# EAGLE schematic Schematico (EAGLE 9.6.2)
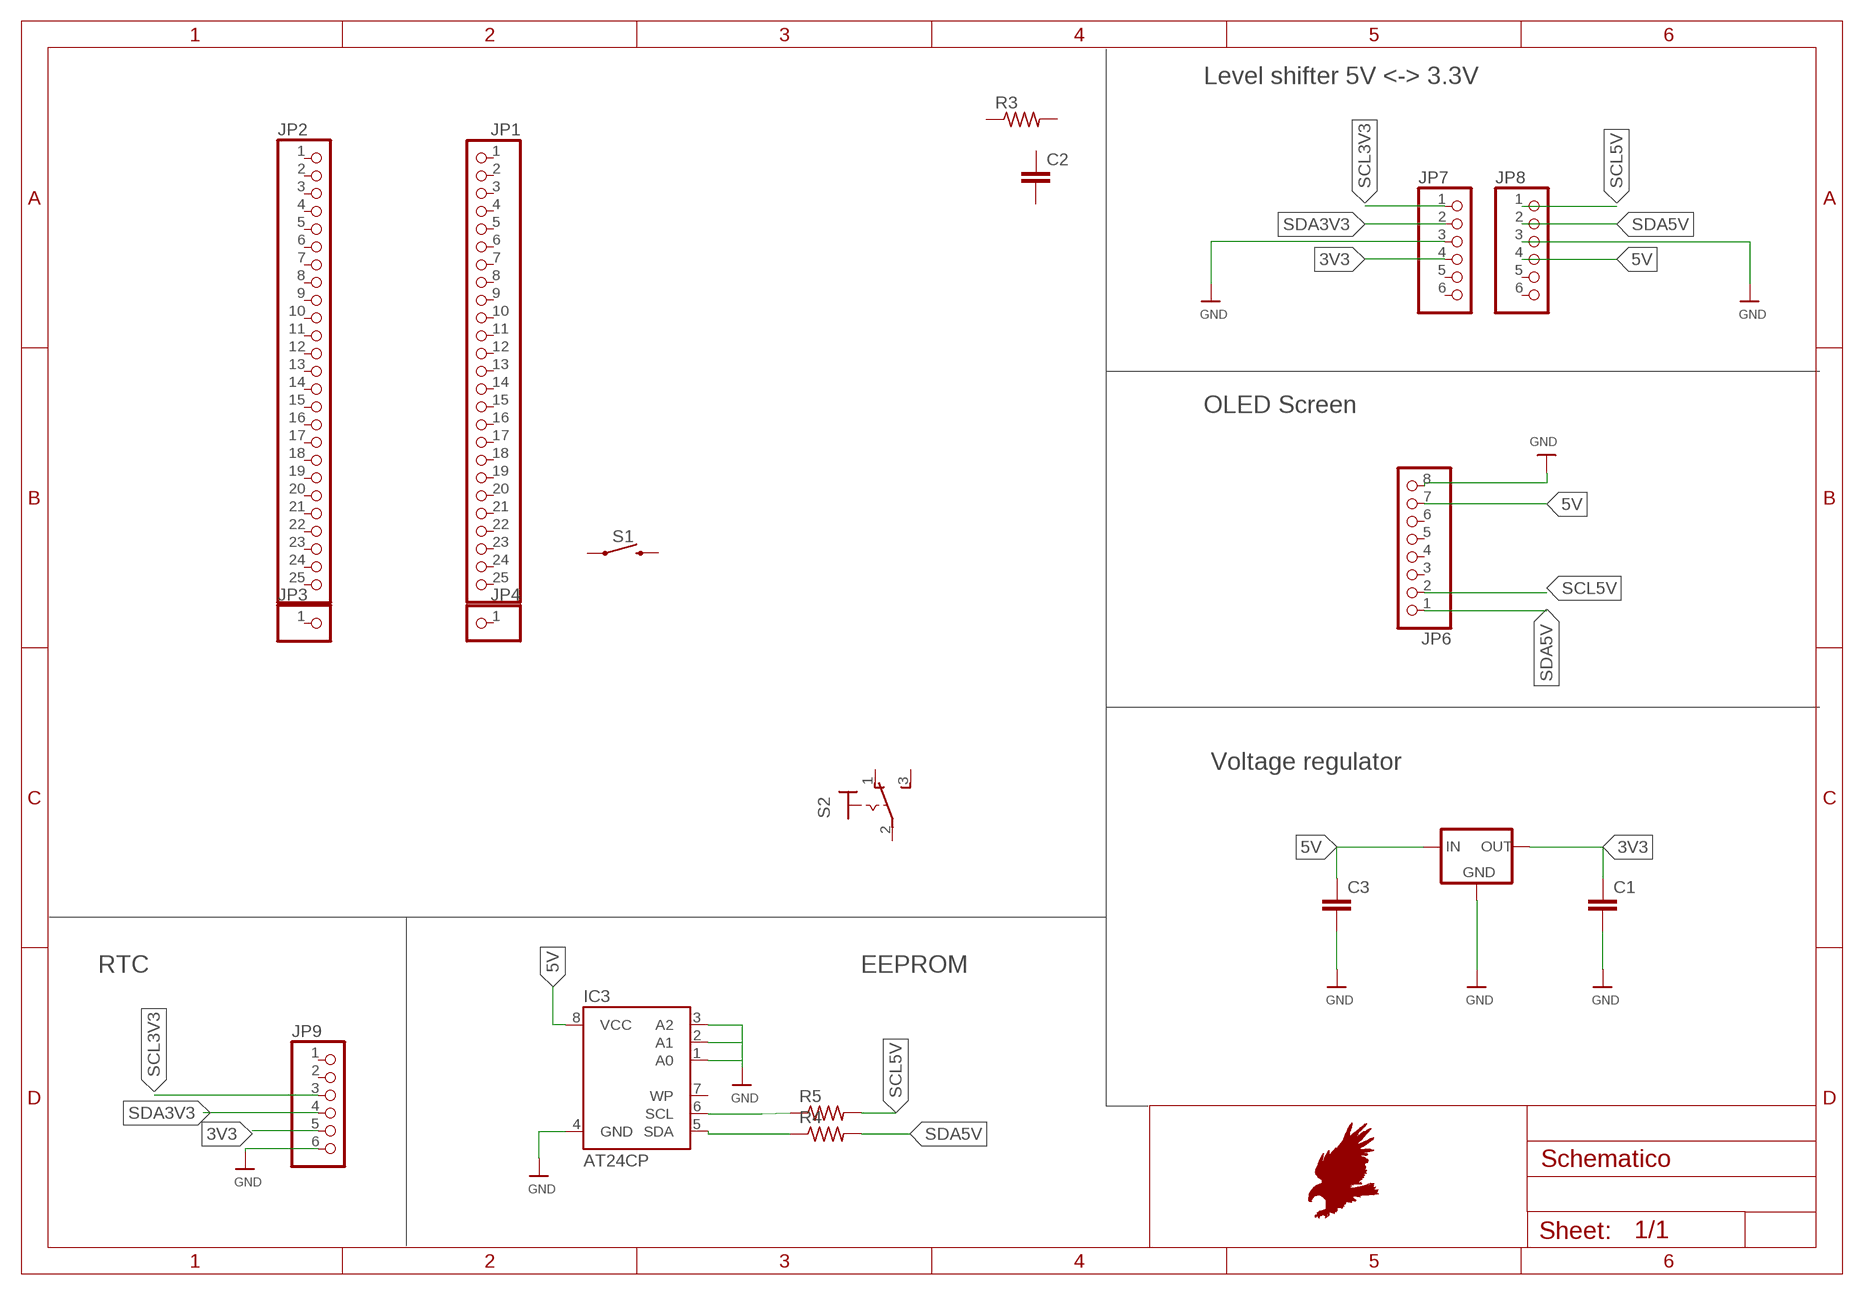
[diagram p0: schematic, sheet 1]

## Parts
C1  C2,5-3  [C2.5-3]
C2  C2,5-3  [C2.5-3]
C3  C2,5-3  [C2.5-3]
IC2  78XXS  [78XXS]
IC3  AT24CP  [DIL08]
JP1  PINHD-1X25  [1X25]
JP2  PINHD-1X25  [1X25]
JP3  PINHD-1X1  [1X01]
JP4  PINHD-1X1  [1X01]
JP6  PINHD-1X8  [1X08]
JP7  PINHD-1X6B  [1X06-BIG]
JP8  PINHD-1X6B  [1X06-BIG]
JP9  PINHD-1X6  [1X06]
R3  R-US_0204/7  [0204/7]
R4  R-US_0204/7  [0204/7]
R5  R-US_0204/7  [0204/7]
S1  MOMENTARY-SWITCH-SPST-PTH-6.0MM  [TACTILE_SWITCH_PTH_6.0MM]
S2  320-916  [320-916]

## Nets
3V3: C1.1 IC2.OUT JP7.4 JP9.5
5V: C3.1 IC2.IN IC3.8(VCC) JP6.7 JP8.4
GND: C1.2 C3.2 IC2.GND IC3.1(A0) IC3.2(A1) IC3.3(A2) IC3.4(GND) JP6.8 JP7.3 JP8.3 JP9.6
N$1: IC3.6(SCL) R5.1
N$2: IC3.5(SDA) R4.1
SCL3V3: JP7.1 JP9.3
SCL5V: JP6.2 JP8.1 R5.2
SDA3V3: JP7.2 JP9.4
SDA5V: JP6.1 JP8.2 R4.2
Unconnected: C2.1 C2.2 IC3.7(WP) JP1.1 JP1.2 JP1.3 JP1.4 JP1.5 JP1.6 JP1.7 JP1.8 JP1.9 JP1.10 JP1.11 JP1.12 JP1.13 JP1.14 JP1.15 JP1.16 JP1.17 JP1.18 JP1.19 JP1.20 JP1.21 JP1.22 JP1.23 JP1.24 JP1.25 JP2.1 JP2.2 JP2.3 JP2.4 JP2.5 JP2.6 JP2.7 JP2.8 JP2.9 JP2.10 JP2.11 JP2.12 JP2.13 JP2.14 JP2.15 JP2.16 JP2.17 JP2.18 JP2.19 JP2.20 JP2.21 JP2.22 JP2.23 JP2.24 JP2.25 JP3.1 JP4.1 JP6.3 JP6.4 JP6.5 JP6.6 JP7.5 JP7.6 JP8.5 JP8.6 JP9.1 JP9.2 R3.1 R3.2 S1.1 S1.3 S2.1(O) S2.2(P) S2.3(S)

## Notes on the sheet
- Level shifter 5V <-> 3.3V
- OLED Screen
- Voltage regulator
- RTC | EEPROM

## Library data of the parts
C1-C3 = capacitor-wima:C: CAPACITOR naming: grid - package width
IC2 = v-reg:78XXS: VOLTAGE REGULATOR
IC3 = atmel:AT24C*: 2-wire serial EEPROM; MPN: AT24C1024BW-SH-B; OC_FARNELL: 1362646; OC_NEWARK: 03P2044
JP1 JP2 = pinhead:PINHD-1X25: PIN HEADER
JP3 JP4 = pinhead:PINHD-1X1: PIN HEADER
JP6 = pinhead:PINHD-1X8: PIN HEADER
JP7 JP8 = adafruit:PINHD-1X6: PIN HEADER
JP9 = pinhead:PINHD-1X6: PIN HEADER
R3-R5 = adafruit:R-US_: RESISTOR, American symbol
S1 = SparkFun-Switches:MOMENTARY-SWITCH-SPST: Momentary Switch (Pushbutton) - SPST Normally-open (NO) SPST momentary switches (buttons, pushbuttons). Variants PTH-12MM - 12mm square, through-hole Momentary Pushbutton Switch - 12mm Square <https://www.sparkfun.com/products/9190> (COM-09190) PTH-6.0MM, PTH-6.0MM-KIT - 6.0mm square, through-hole Mini Pushbutton Switch <https://www.sparkfun.com/products/97> (COM-00097) KIT package intended for soldering kit's - only one side of pads' copper is exposed. PTH-RIGHT-ANGLE-KIT - Right-angle, through-hole Right Angle Tactile Button <https://www.sparkfun.com/products/10791> - Used on SparkFun BigTime Watch Kit <https://www.sparkfun.com/products/11734> SMD-12MM - 12mm square, surface-mount Tactile Button - SMD (12mm) <https://www.sparkfun.com/products/12993> (COM-12993) Used on SparkFun PicoBoard <https://www.sparkfun.com/products/11888> SMD-4.5MM - 4.5mm Square Trackball Switch Used on SparkFun Blackberry Trackballer Breakout <https://www.sparkfun.com/products/13169> SMD-4.6MMX2.8MM - 4.60mm x 2.80mm, surface mount Used on SparkFun SAMD21 Mini Breakout <https://www.sparkfun.com/products/13664> SMD-5.2MM, SMD-5.2-REDUNDANT - 5.2mm square, surface-mount Mini Pushbutton Switch - SMD <https://www.sparkfun.com/products/8720> (COM-08720) Used on Arduino Pro Mini <https://www.sparkfun.com/products/11114> REDUNDANT package connects both switch circuits together SMD-6.0X3.5MM - 6.0 x 3.5mm, surface mount Momentary Reset Switch SMD <https://www.sparkfun.com/products/8229> (COM-08229) SMD-6.2MM-TALL - 6.2mm square, surface mount Tactile Button - SMD (6mm) <https://www.sparkfun.com/products/12992> Used on SparkFun Digital Sandbox <https://www.sparkfun.com/products/12651> SMD-RIGHT-ANGLE - Right-angle, surface mount Used on SparkFun Block for Intel® Edison - Arduino <https://www.sparkfun.com/products/13036>; PROD_ID: SWCH-08441; SF_SKU: COM-00097
S2 = switch:320-916: TOGGLE SWITCH distributor RS Components